# Altium project SDC_2.PrjPcb
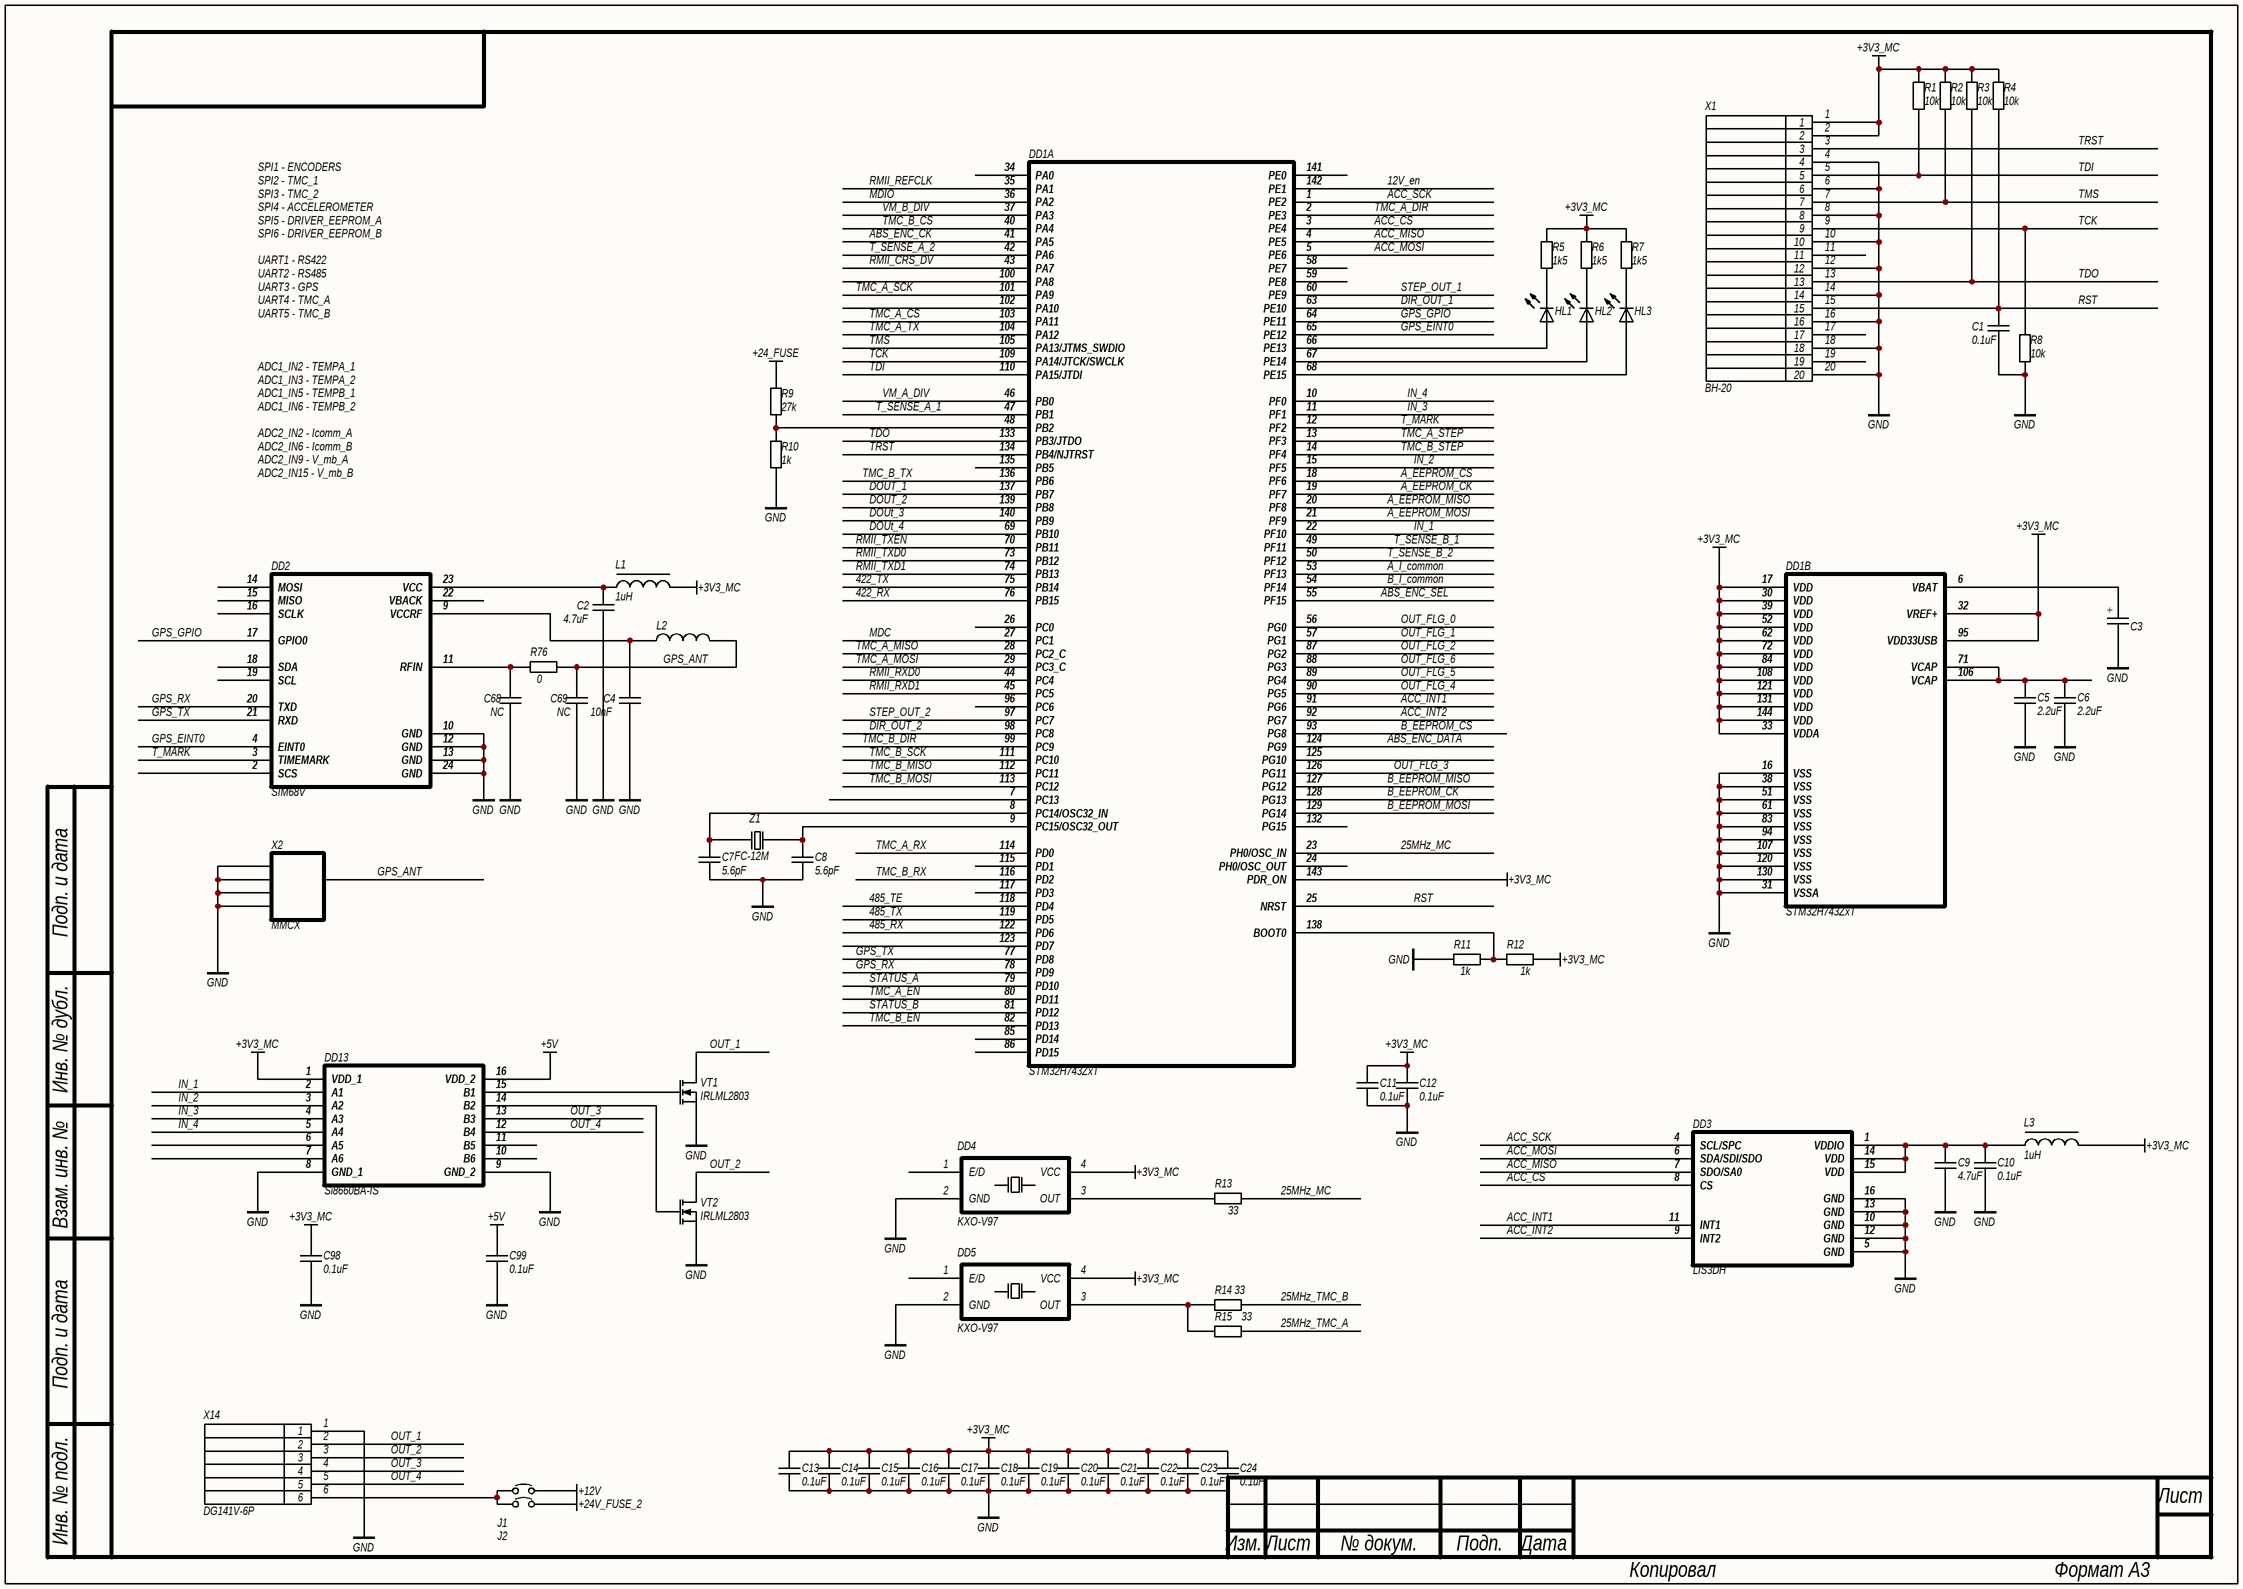
[diagram p0: SDC_1.SchDoc]
2 sheets, 135 parts. Net scope: global (net labels, ports and power ports of the same name join across sheets).
Board file: SDC.PcbDoc
Sheets:
  SDC_1.SchDoc
  SDC_2.SchDoc

## Sheet SDC_1.SchDoc
size 420 x 297 mm; Scale: {Мш.}; PageSetup: Record=PageOptions|CenterHorizontal=False|CenterVertical=False|PrintScale=0.49|XCorrection=0.00|YCorrection=0.00|PrintKind=1|BorderSize=5000000|LeftOffset=0|BottomOffset=0|Orientation=1|PaperLength=1000|PaperWidth=1000|Scale=100|PaperSource=15|PrintQuality=600|MediaType=1|DitherType=10|PrintScaleMode=1|PaperKind=A4; ProcessInspection: {Т.контр.}; Mass: {М.}; NormInspection: {Н.контр.}; Letter1Column: {}; Letter2Column: {}; Letter3Column: {}; DocumentType: {Документ}

### Parts
C1  value 0.1uF  [C0603]  (hidden comment: CAP)
C2  value 4.7uF  [C0603]  (hidden comment: CAP)
C3  KR-5R5H155-R  [KR-5R5H155-R]  (value not drawn)
C4  value 10nF  [C0603]  (hidden comment: CAP)
C5  value 2.2uF  [C0603]  (hidden comment: CAP)
C6  value 2.2uF  [C0603]  (hidden comment: CAP)
C7  value 5.6pF  [C0603]  (hidden comment: CAP)
C8  value 5.6pF  [C0603]  (hidden comment: CAP)
C9  value 4.7uF  [C0603]  (hidden comment: CAP)
C10  value 0.1uF  [C0603]  (hidden comment: CAP)
C11  value 0.1uF  [C0603]  (hidden comment: CAP)
C12  value 0.1uF  [C0603]  (hidden comment: CAP)
C13  value 0.1uF  [C0603]  (hidden comment: CAP)
C14  value 0.1uF  [C0603]  (hidden comment: CAP)
C15  value 0.1uF  [C0603]  (hidden comment: CAP)
C16  value 0.1uF  [C0603]  (hidden comment: CAP)
C17  value 0.1uF  [C0603]  (hidden comment: CAP)
C18  value 0.1uF  [C0603]  (hidden comment: CAP)
C19  value 0.1uF  [C0603]  (hidden comment: CAP)
C20  value 0.1uF  [C0603]  (hidden comment: CAP)
C21  value 0.1uF  [C0603]  (hidden comment: CAP)
C22  value 0.1uF  [C0603]  (hidden comment: CAP)
C23  value 0.1uF  [C0603]  (hidden comment: CAP)
C24  value 0.1uF  [C0603]  (hidden comment: CAP)
C68  value NC  [C0603]  (hidden comment: CAP)
C69  value NC  [C0603]  (hidden comment: CAP)
C98  value 0.1uF  [C0603]  (hidden comment: CAP)
C99  value 0.1uF  [C0603]  (hidden comment: CAP)
DD1  STM32H743ZxT  [STM-LQFP144_L]  (parts A,B of 2)
DD2  SIM68V  [SIM68M]
DD3  LIS3DH  [LGA-16]
DD4  KXO-V97  [SO4-GEN]
DD5  KXO-V97  [SO4-GEN]
DD13  Si8660BA-IS  [SO-16_N]
HL1  LED0603  [LED0603]  (value not drawn)
HL2  LED0603  [LED0603]  (value not drawn)
HL3  LED0603  [LED0603]  (value not drawn)
J1  JUMP  [JUMP]  (value not drawn)
J2  JUMP  [JUMP]  (value not drawn)
L1  value 1uH  [LQH32CN]  (hidden comment: LQH32CN)
L2  FerriteBead  [L0603]  (value not drawn)
L3  value 1uH  [LQH32CN]  (hidden comment: LQH32CN)
R1  value 10k  [R0603]  (hidden comment: RES)
R2  value 10k  [R0603]  (hidden comment: RES)
R3  value 10k  [R0603]  (hidden comment: RES)
R4  value 10k  [R0603]  (hidden comment: RES)
R5  value 1k5  [R0603]  (hidden comment: RES)
R6  value 1k5  [R0603]  (hidden comment: RES)
R7  value 1k5  [R0603]  (hidden comment: RES)
R8  value 10k  [R0603]  (hidden comment: RES)
R9  value 27k  [R0603]  (hidden comment: RES)
R10  value 1k  [R0603]  (hidden comment: RES)
R11  value 1k  [R0603]  (hidden comment: RES)
R12  value 1k  [R0603]  (hidden comment: RES)
R13  value 33  [R0603]  (hidden comment: RES)
R14  value 33  [R0603]  (hidden comment: RES)
R15  value 33  [R0603]  (hidden comment: RES)
R76  value 0  [R0603]  (hidden comment: RES)
VT1  IRLML2803  [SOT23]
VT2  IRLML2803  [SOT23]
X1  BH-20  [IDC-20(BH-20)]
X2  MMCX  [MMCX]
X14  DG141V-6P  [DG141V-06P]
Z1  FC-12M  [FC-12M]

### Nets
+3V3_MC: C11.2 C12.2 C13.2 C14.2 C15.2 C16.2 C17.2 C18.2 C19.2 C20.2 C21.2 C22.2 C23.2 C24.2 C98.2 DD1.17(VDD) DD1.30(VDD) DD1.32(VREF+) DD1.33(VDDA) DD1.39(VDD) DD1.52(VDD) DD1.62(VDD) DD1.72(VDD) DD1.84(VDD) DD1.95(VDD33USB) DD1.108(VDD) DD1.121(VDD) DD1.131(VDD) DD1.143(PDR_ON) DD1.144(VDD) DD4.4(VCC) DD5.4(VCC) DD13.1(VDD_1) L1.2 L3.2 R1.1 R2.1 R3.1 R4.1 R5.1 R6.1 R7.1 R12.1 X1.1 X1.2
+5V: C99.2 DD13.16(VDD_2)
+12V: J1.2
+24_FUSE: R9.2
+24V_FUSE_2: J2.2
GND: C1.1 C2.1 C3.1 C4.1 C5.1 C6.1 C7.1 C8.1 C9.1 C10.1 C11.1 C12.1 C13.1 C14.1 C15.1 C16.1 C17.1 C18.1 C19.1 C20.1 C21.1 C22.1 C23.1 C24.1 C68.1 C69.1 C98.1 C99.1 DD1.16(VSS) DD1.31(VSSA) DD1.38(VSS) DD1.51(VSS) DD1.61(VSS) DD1.83(VSS) DD1.94(VSS) DD1.107(VSS) DD1.120(VSS) DD1.130(VSS) DD2.10(GND) DD2.12(GND) DD2.13(GND) DD2.24(GND) DD3.5(GND) DD3.10(GND) DD3.12(GND) DD3.13(GND) DD3.16(GND) DD4.2(GND) DD5.2(GND) DD13.8(GND_1) DD13.9(GND_2) R8.2 R10.1 R11.2 VT1.2(S) VT2.2(S) X1.4 X1.6 X1.8 X1.10 X1.12 X1.14 X1.16 X1.18 X1.20 X2.1(GND) X2.2(GND) X2.3(GND) X2.4(GND) X14.1
12V_en: DD1.142(PE1)
25MHz_MC: DD1.23(PH0/OSC_IN) R13.1
25MHz_TMC_A: R15.1
25MHz_TMC_B: R14.1
422_RX: DD1.76(PB15)
422_TX: DD1.75(PB14)
485_RX: DD1.122(PD6)
485_TE: DD1.118(PD4)
485_TX: DD1.119(PD5)
A_EEPROM_CK: DD1.19(PF7)
A_EEPROM_CS: DD1.18(PF6)
A_EEPROM_MISO: DD1.20(PF8)
A_EEPROM_MOSI: DD1.21(PF9)
A_I_common: DD1.53(PF13)
ABS_ENC_CK: DD1.41(PA5)
ABS_ENC_DATA: DD1.124(PG9)
ABS_ENC_SEL: DD1.55(PF15)
ACC_CS: DD1.3(PE4) DD3.8(CS)
ACC_INT1: DD1.91(PG6) DD3.11(INT1)
ACC_INT2: DD1.92(PG7) DD3.9(INT2)
ACC_MISO: DD1.4(PE5) DD3.7(SDO/SA0)
ACC_MOSI: DD1.5(PE6) DD3.6(SDA/SDI/SDO)
ACC_SCK: DD1.1(PE2) DD3.4(SCL/SPC)
B_EEPROM_CK: DD1.128(PG13)
B_EEPROM_CS: DD1.93(PG8)
B_EEPROM_MISO: DD1.127(PG12)
B_EEPROM_MOSI: DD1.129(PG14)
B_I_common: DD1.54(PF14)
DIR_OUT_1: DD1.63(PE10)
DIR_OUT_2: DD1.98(PC8)
DOUT_1: DD1.137(PB7)
DOUT_2: DD1.139(PB8)
DOUt_3: DD1.140(PB9)
DOUt_4: DD1.69(PB10)
GPS_ANT: C69.2 L2.2 R76.1 X2.5(SYG)
GPS_EINT0: DD1.65(PE12) DD2.4(EINT0)
GPS_GPIO: DD1.64(PE11) DD2.17(GPIO0)
GPS_RX: DD1.78(PD9) DD2.20(TXD)
GPS_TX: DD1.77(PD8) DD2.21(RXD)
IN_1: DD1.22(PF10) DD13.2(A1)
IN_2: DD1.15(PF5) DD13.3(A2)
IN_3: DD1.11(PF1) DD13.4(A3)
IN_4: DD1.10(PF0) DD13.5(A4)
MDC: DD1.27(PC1)
MDIO: DD1.36(PA2)
OUT_1: VT1.3(D) X14.2
OUT_2: VT2.3(D) X14.3
OUT_3: DD13.13(B3) X14.4
OUT_4: DD13.12(B4) X14.5
OUT_FLG_0: DD1.56(PG0)
OUT_FLG_1: DD1.57(PG1)
OUT_FLG_2: DD1.87(PG2)
OUT_FLG_3: DD1.126(PG11)
OUT_FLG_4: DD1.90(PG5)
OUT_FLG_5: DD1.89(PG4)
OUT_FLG_6: DD1.88(PG3)
RMII_CRS_DV: DD1.43(PA7)
RMII_REFCLK: DD1.35(PA1)
RMII_RXD0: DD1.44(PC4)
RMII_RXD1: DD1.45(PC5)
RMII_TXD0: DD1.73(PB12)
RMII_TXD1: DD1.74(PB13)
RMII_TXEN: DD1.70(PB11)
RST: C1.2 DD1.25(NRST) R4.2 X1.15
STATUS_A: DD1.79(PD10)
STATUS_B: DD1.81(PD12)
STEP_OUT_1: DD1.60(PE9)
STEP_OUT_2: DD1.97(PC7)
T_MARK: DD1.12(PF2) DD2.3(TIMEMARK)
T_SENSE_A_1: DD1.47(PB1)
T_SENSE_A_2: DD1.42(PA6)
T_SENSE_B_1: DD1.49(PF11)
T_SENSE_B_2: DD1.50(PF12)
TCK: DD1.109(PA14/JTCK/SWCLK) R8.1 X1.9
TDI: DD1.110(PA15/JTDI) R1.2 X1.5
TDO: DD1.133(PB3/JTDO) R3.2 X1.13
TMC_A_CS: DD1.103(PA11)
TMC_A_DIR: DD1.2(PE3)
TMC_A_EN: DD1.80(PD11)
TMC_A_MISO: DD1.28(PC2_C)
TMC_A_MOSI: DD1.29(PC3_C)
TMC_A_RX: DD1.114(PD0)
TMC_A_SCK: DD1.101(PA9)
TMC_A_STEP: DD1.13(PF3)
TMC_A_TX: DD1.104(PA12)
TMC_B_CS: DD1.40(PA4)
TMC_B_DIR: DD1.99(PC9)
TMC_B_EN: DD1.82(PD13)
TMC_B_MISO: DD1.112(PC11)
TMC_B_MOSI: DD1.113(PC12)
TMC_B_RX: DD1.116(PD2)
TMC_B_SCK: DD1.111(PC10)
TMC_B_STEP: DD1.14(PF4)
TMC_B_TX: DD1.136(PB6)
TMS: DD1.105(PA13/JTMS_SWDIO) R2.2 X1.7
TRST: DD1.134(PB4/NJTRST) X1.3
VM_A_DIV: DD1.46(PB0)
VM_B_DIV: DD1.37(PA3)
NetC2_2: C2.2 DD2.23(VCC) L1.1
NetC3_2: C3.2 DD1.6(VBAT)
NetC4_2: C4.2 DD2.9(VCCRF) L2.1
NetC5_2: C5.2 C6.2 DD1.71(VCAP) DD1.106(VCAP)
NetC7_2: C7.2 DD1.8(PC14/OSC32_IN) Z1.1
NetC8_2: C8.2 DD1.9(PC15/OSC32_OUT) Z1.2
NetC9_2: C9.2 C10.2 DD3.1(VDDIO) DD3.14(VDD) DD3.15(VDD) L3.1
NetC68_2: C68.2 DD2.11(RFIN) R76.2
NetDD1_48: DD1.48(PB2) R9.1 R10.2
NetDD1_66: DD1.66(PE13) HL1.1(A)
NetDD1_67: DD1.67(PE14) HL2.1(A)
NetDD1_68: DD1.68(PE15) HL3.1(A)
NetDD1_138: DD1.138(BOOT0) R11.1 R12.2
NetDD4_3: DD4.3(OUT) R13.2
NetDD5_3: DD5.3(OUT) R14.2 R15.2
NetDD13_14: DD13.14(B2) VT2.1(G)
NetDD13_15: DD13.15(B1) VT1.1(G)
NetHL1_2: HL1.2(K) R5.2
NetHL2_2: HL2.2(K) R6.2
NetHL3_2: HL3.2(K) R7.2
NetJ1_1: J1.1 J2.1 X14.6

Not connected (* = marked no-connect by the designer): DD1 7(PC13) 24(PH0/OSC_OUT) 26(PC0) 34(PA0) 58(PE7) 59(PE8) 85(PD14) 86(PD15) 96(PC6) 100(PA8) 102(PA10) 115(PD1) 117(PD3) 123(PD7) 125(PG10) 132(PG15) 135(PB5) 141(PE0); DD2 2(SCS) 14(MOSI) 15(MISO) 16(SCLK) 18(SDA) 19(SCL) 22(VBACK); DD4 1(E/D); DD5 1(E/D); DD13 6(A5) 7(A6) 10(B6) 11(B5); X1 11 17 19

### Notes on the sheet
- SPI1 - ENCODERS
- SPI2 - TMC_1
- SPI3 - TMC_2
- SPI4 - ACCELEROMETER
- SPI5 - DRIVER_EEPROM_A
- SPI6 - DRIVER_EEPROM_B
- UART1 - RS422
- UART2 - RS485
- UART3 - GPS
- UART4 - TMC_A
- UART5 - TMC_B
- ADC1_IN2 - TEMPA_1
- ADC1_IN3 - TEMPA_2
- ADC1_IN5 - TEMPB_1
- ADC1_IN6 - TEMPB_2
- ADC2_IN2 - Icomm_A
- ADC2_IN6 - Icomm_B
- ADC2_IN9 - V_mb_A
- ADC2_IN15 - V_mb_B
- Подп. и дата
- Инв. № дубл.
- Взам. инв. №
- Инв. № подл.
- Лист
- Изм.
- № докум.
- Подп.
- Дата
- Копировал
- Формат А3
- (in symbol KR-5R5H155-R) +

### Library data of the parts
C1 C5-C8 C10-C24 C98 C99 = CAP: SMD Capacitor; Manufacturer: Murata; Material: X7R; Tolerance: 10%; Voltage: 50V; Type: Ceramic Capacitor
C2 C4 C9 C68 C69 = CAP: SMD Capacitor; Manufacturer: Murata; Material: X7R; Tolerance: 10%; Voltage: 10V; Type: Ceramic Capacitor
C3 = KR-5R5H155-R: Ionistor; Manufacturer: Murata; Voltage: 5V; Type: Aluminum; Value: 1.5F
DD1 = STM32H743ZxT: ARM Cortex-M7, 480MHz, 32-bit MCU+FPU, 144-pin LQFP
DD2 = SIM68V: GPS module
DD3 = LIS3DH: Accelerometer
DD4 DD5 = KXO-V97: KXO generator
DD13 = Si8660BA-IS: digital isolator
L1 L3 = LQH32CN: chip inductor
L2 = FerriteBead: SMD Chip ferrite bead 0603; value: 600R; PartNumber: *; Manufacturer: *
R1-R15 R76 = RES: SMD Resistor; Name: Chip SMD Resistor; Power: 0.062 Wt; Tolerance: 5%; Temperature Range: -55…155°C
VT1 VT2 = IRLML2803: n-channel fet
X1 = IDC10x2_GOST
X2 = MMCX: Coaxial
X14 = DG141V-6P: wire connector
Z1 = FC-12M: Crystal_32_768
J1 J2 = JUMP: PACKAGE: PLS2; NOTE: *

## Sheet SDC_2.SchDoc
size 420 x 297 mm; PageSetup: Record=PageOptions|CenterHorizontal=False|CenterVertical=False|PrintScale=0.95|XCorrection=0.00|YCorrection=0.00|PrintKind=1|BorderSize=5000000|LeftOffset=0|BottomOffset=0|Orientation=1|PaperLength=1000|PaperWidth=1000|Scale=100|PaperSource=15|PrintQuality=600|MediaType=1|DitherType=10|PaperKind=A4|PrintScaleMode=1
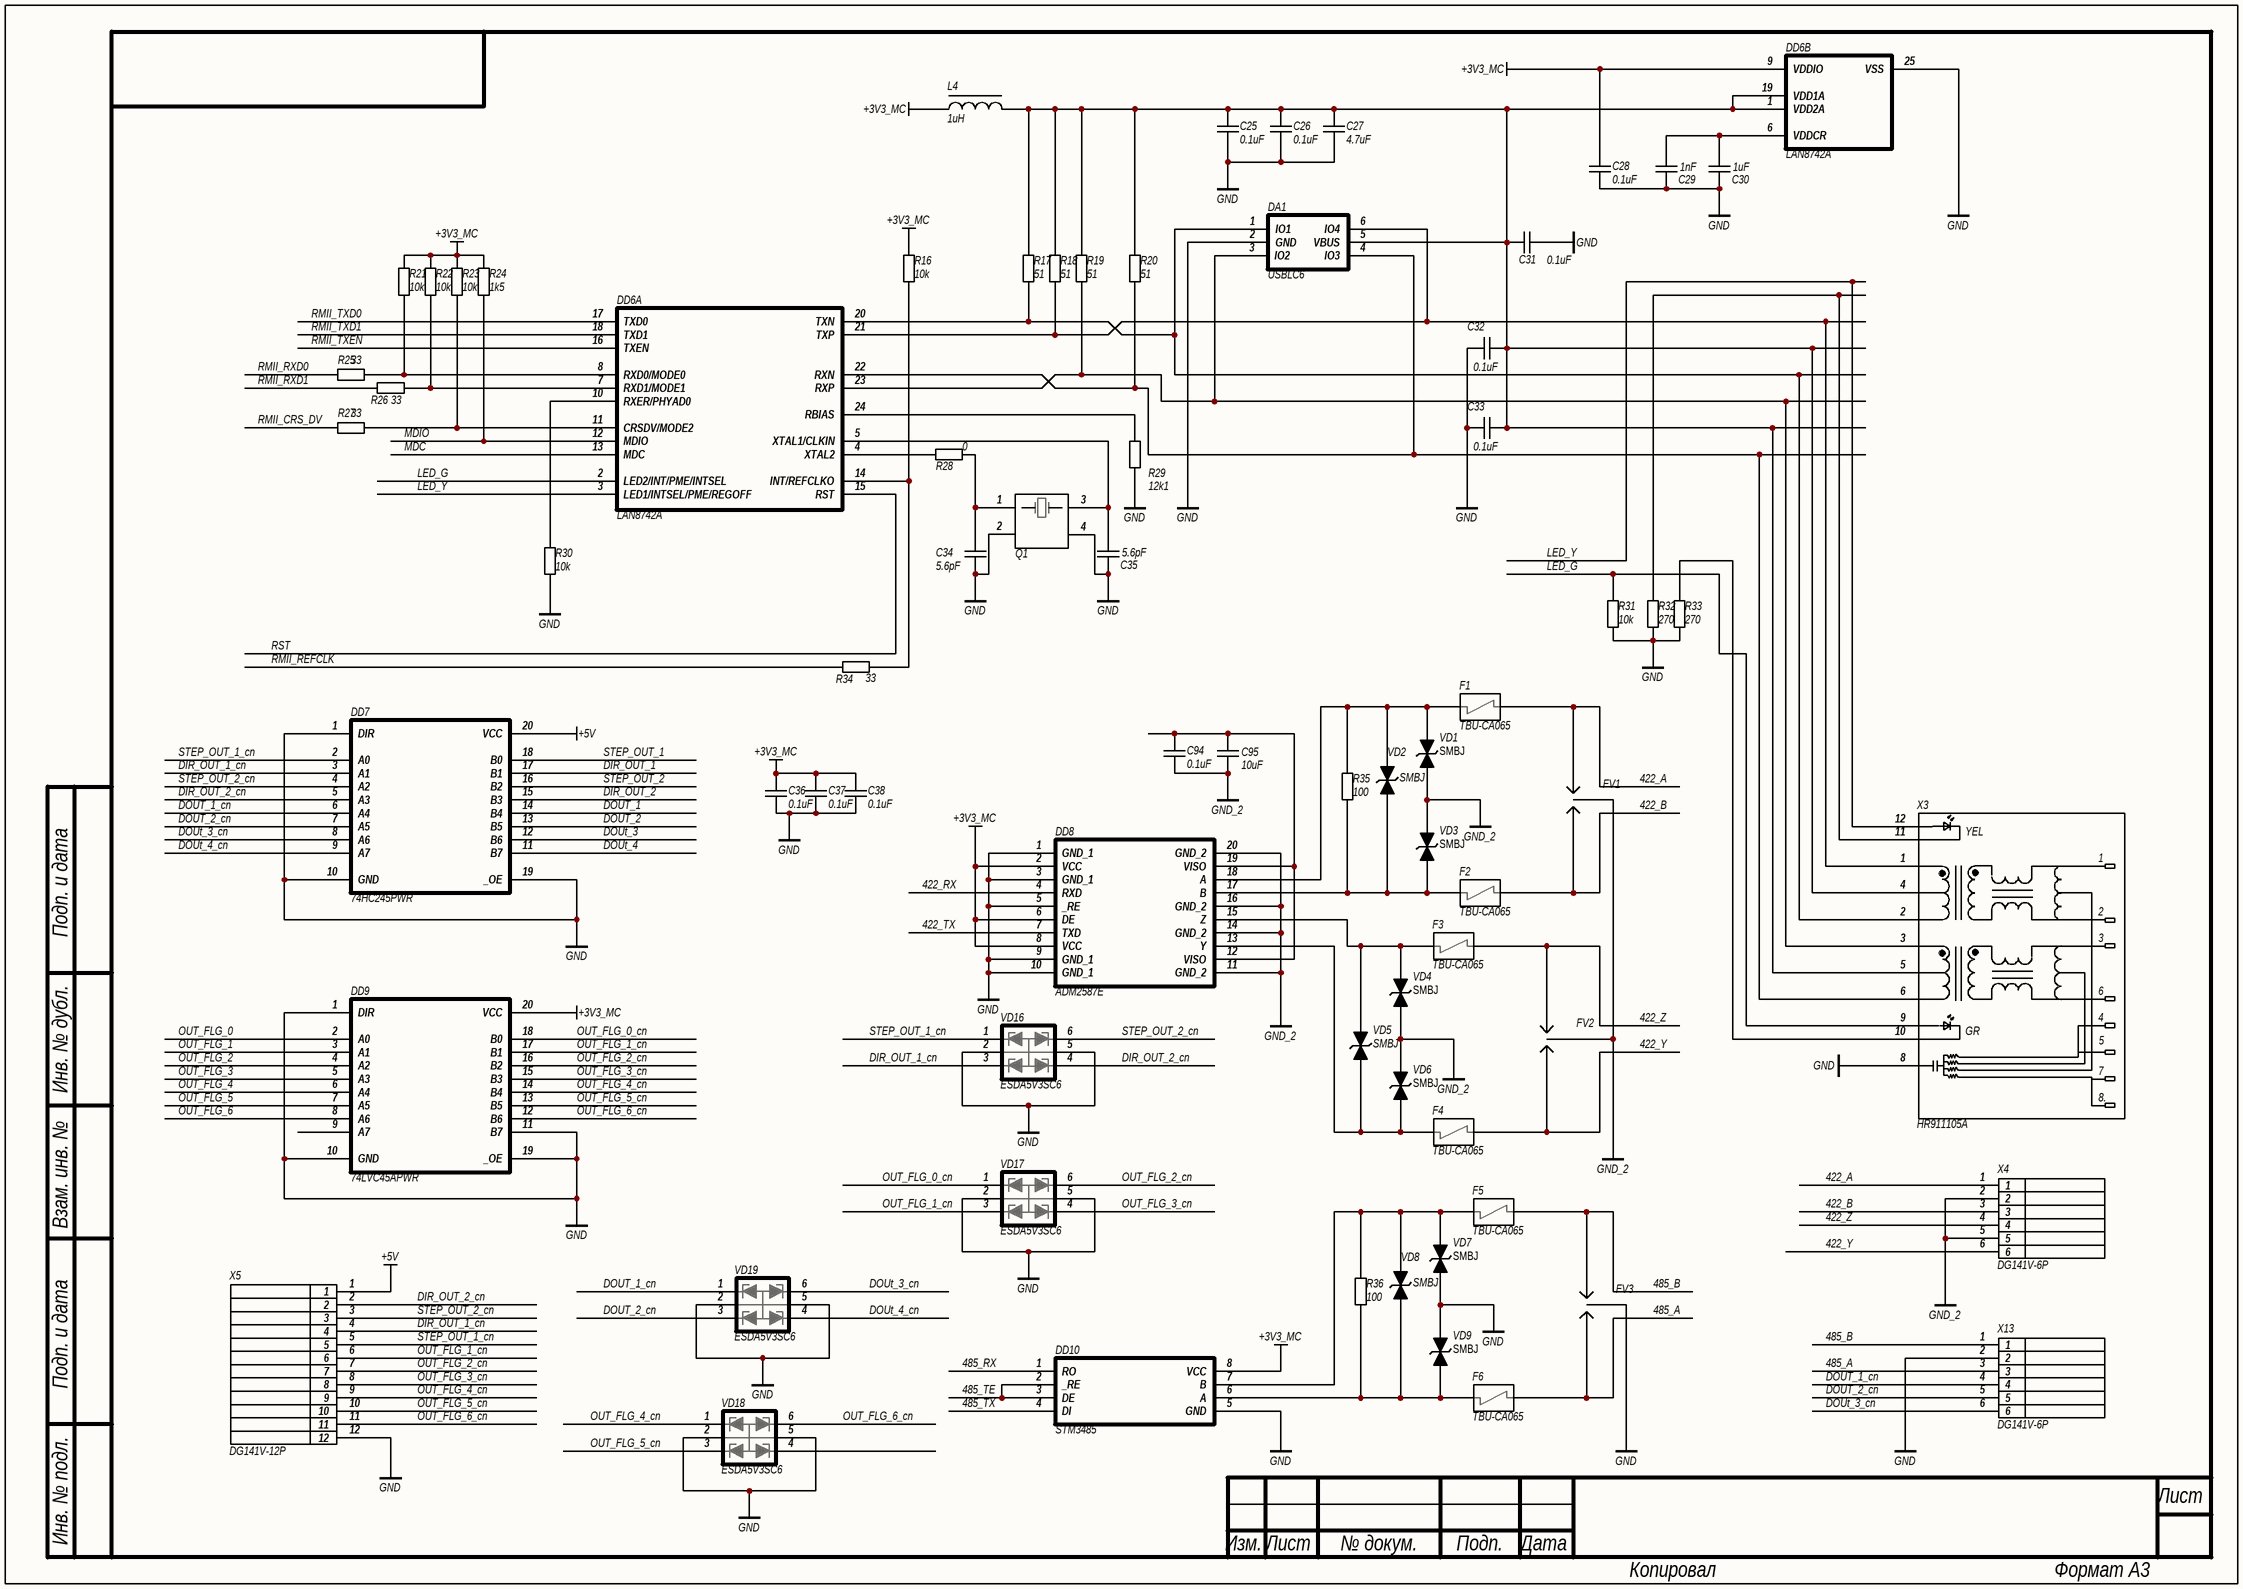
[diagram p1: SDC_2.SchDoc]

### Parts
C25  value 0.1uF  [C0603]  (hidden comment: CAP)
C26  value 0.1uF  [C0603]  (hidden comment: CAP)
C27  value 4.7uF  [C0603]  (hidden comment: CAP)
C28  value 0.1uF  [C0603]  (hidden comment: CAP)
C29  value 1nF  [C0603]  (hidden comment: CAP)
C30  value 1uF  [C0603]  (hidden comment: CAP)
C31  value 0.1uF  [C0603]  (hidden comment: CAP)
C32  value 0.1uF  [C0603]  (hidden comment: CAP)
C33  value 0.1uF  [C0603]  (hidden comment: CAP)
C34  value 5.6pF  [C0603]  (hidden comment: CAP)
C35  value 5.6pF  [C0603]  (hidden comment: CAP)
C36  value 0.1uF  [C0603]  (hidden comment: CAP)
C37  value 0.1uF  [C0603]  (hidden comment: CAP)
C38  value 0.1uF  [C0603]  (hidden comment: CAP)
C94  value 0.1uF  [C0603]  (hidden comment: CAP)
C95  value 10uF  [C1210]  (hidden comment: CAP)
DA1  USBLC6  [ESD_SOT23-6L]
DD6  LAN8742A  [QFN-MJ24]  (parts A,B of 2)
DD7  74HC245PWR  [TSSOP20]
DD8  ADM2587E  [SOIC_20W]
DD9  74LVC45APWR  [TSSOP20]
DD10  STM3485  [SO8_L]
F1  TBU-CA065  [TBU-CA]
F2  TBU-CA065  [TBU-CA]
F3  TBU-CA065  [TBU-CA]
F4  TBU-CA065  [TBU-CA]
F5  TBU-CA065  [TBU-CA]
F6  TBU-CA065  [TBU-CA]
FV1  2030-42T-SM  [2030-42T-SM]  (value not drawn)
FV2  2030-42T-SM  [2030-42T-SM]  (value not drawn)
FV3  2030-42T-SM  [2030-42T-SM]  (value not drawn)
L4  value 1uH  [LQH32CN]  (hidden comment: LQH32CN)
Q1  NX2016SA  [CRY_NX2016SA_4P]  (value not drawn)
R16  value 10k  [R0603]  (hidden comment: RES)
R17  value 51  [R0603]  (hidden comment: RES)
R18  value 51  [R0603]  (hidden comment: RES)
R19  value 51  [R0603]  (hidden comment: RES)
R20  value 51  [R0603]  (hidden comment: RES)
R21  value 10k  [R0603]  (hidden comment: RES)
R22  value 10k  [R0603]  (hidden comment: RES)
R23  value 10k  [R0603]  (hidden comment: RES)
R24  value 1k5  [R0603]  (hidden comment: RES)
R25  value 33  [R0603]  (hidden comment: RES)
R26  value 33  [R0603]  (hidden comment: RES)
R27  value 33  [R0603]  (hidden comment: RES)
R28  value 0  [R0603]  (hidden comment: RES)
R29  value 12k1  [R0603]  (hidden comment: RES)
R30  value 10k  [R0603]  (hidden comment: RES)
R31  value 10k  [R0603]  (hidden comment: RES)
R32  value 270  [R0603]  (hidden comment: RES)
R33  value 270  [R0603]  (hidden comment: RES)
R34  value 33  [R0603]  (hidden comment: RES)
R35  value 100  [R0603]  (hidden comment: RES)
R36  value 100  [R0603]  (hidden comment: RES)
VD1  SMBJ  [SMB-DO214]
VD2  SMBJ  [SMB-DO214]
VD3  SMBJ  [SMB-DO214]
VD4  SMBJ  [SMB-DO214]
VD5  SMBJ  [SMB-DO214]
VD6  SMBJ  [SMB-DO214]
VD7  SMBJ  [SMB-DO214]
VD8  SMBJ  [SMB-DO214]
VD9  SMBJ  [SMB-DO214]
VD16  ESDA5V3SC6  [SOT23-6]
VD17  ESDA5V3SC6  [SOT23-6]
VD18  ESDA5V3SC6  [SOT23-6]
VD19  ESDA5V3SC6  [SOT23-6]
X3  HR911105A  [HR911105A]
X4  DG141V-6P  [DG141V-06P]
X5  DG141V-12P  [DG141V-12P]
X13  DG141V-6P  [DG141V-06P]

### Nets
+3V3_MC: C28.2 C36.2 C37.2 C38.2 DD6.9(VDDIO) DD8.2(VCC) DD8.6(DE) DD8.8(VCC) DD9.20(VCC) DD10.8(VCC) L4.1 R16.1 R21.1 R22.1 R23.1 R24.1
+5V: DD7.20(VCC) X5.1
GND: C25.1 C26.1 C27.1 C28.1 C29.1 C30.1 C31.2 C32.1 C33.1 C34.1 C35.1 C36.1 C37.1 C38.1 DA1.2(GND) DD6.25(VSS) DD7.1(DIR) DD7.10(GND) DD7.19(_OE) DD8.1(GND_1) DD8.3(GND_1) DD8.5(_RE) DD8.9(GND_1) DD8.10(GND_1) DD9.1(DIR) DD9.10(GND) DD9.11(B7) DD9.19(_OE) DD10.5(GND) FV3.2 Q1.2(OSC1) Q1.4(OSC1) R29.1 R30.1 R31.1 R32.1 R33.1 VD7.1(A) VD9.2(B) VD16.2 VD16.5 VD17.2 VD17.5 VD18.2 VD18.5 VD19.2 VD19.5 X3.8 X5.12 X13.2
GND_2: C94.1 C95.1 DD8.11(GND_2) DD8.14(GND_2) DD8.16(GND_2) DD8.20(GND_2) FV1.2 FV2.2 VD1.1(A) VD3.2(B) VD4.1(A) VD6.2(B) X4.2 X4.5
422_A: F1.2 FV1.3 X4.1
422_B: F2.2 FV1.1 X4.3
422_RX: DD8.4(RXD)
422_TX: DD8.7(TXD)
422_Y: F4.2 FV2.1 X4.6
422_Z: F3.2 FV2.3 X4.4
485_A: F6.2 FV3.1 X13.3
485_B: F5.2 FV3.3 X13.1
485_RX: DD10.1(RO)
485_TE: DD10.2(_RE) DD10.3(DE)
485_TX: DD10.4(DI)
DIR_OUT_1: DD7.17(B1)
DIR_OUT_1_cn: DD7.3(A1) VD16.3 X5.4
DIR_OUT_2: DD7.15(B3)
DIR_OUT_2_cn: DD7.5(A3) VD16.4 X5.2
DOUT_1: DD7.14(B4)
DOUT_1_cn: DD7.6(A4) VD19.1 X13.4
DOUT_2: DD7.13(B5)
DOUT_2_cn: DD7.7(A5) VD19.3 X13.5
DOUt_3: DD7.12(B6)
DOUt_3_cn: DD7.8(A6) VD19.6 X13.6
DOUt_4: DD7.11(B7)
DOUt_4_cn: DD7.9(A7) VD19.4
LED_G: DD6.2(LED2/INT/PME/INTSEL) R31.2 X3.9
LED_Y: DD6.3(LED1/INTSEL/PME/REGOFF) X3.12
MDC: DD6.13(MDC)
MDIO: DD6.12(MDIO) R24.2
OUT_FLG_0: DD9.2(A0)
OUT_FLG_0_cn: DD9.18(B0) VD17.1
OUT_FLG_1: DD9.3(A1)
OUT_FLG_1_cn: DD9.17(B1) VD17.3 X5.6
OUT_FLG_2: DD9.4(A2)
OUT_FLG_2_cn: DD9.16(B2) VD17.6 X5.7
OUT_FLG_3: DD9.5(A3)
OUT_FLG_3_cn: DD9.15(B3) VD17.4 X5.8
OUT_FLG_4: DD9.6(A4)
OUT_FLG_4_cn: DD9.14(B4) VD18.1 X5.9
OUT_FLG_5: DD9.7(A5)
OUT_FLG_5_cn: DD9.13(B5) VD18.3 X5.10
OUT_FLG_6: DD9.8(A6)
OUT_FLG_6_cn: DD9.12(B6) VD18.6 X5.11
RMII_CRS_DV: R27.2
RMII_REFCLK: R34.2
RMII_RXD0: R25.2
RMII_RXD1: R26.2
RMII_TXD0: DD6.17(TXD0)
RMII_TXD1: DD6.18(TXD1)
RMII_TXEN: DD6.16(TXEN)
RST: DD6.15(RST)
STEP_OUT_1: DD7.18(B0)
STEP_OUT_1_cn: DD7.2(A0) VD16.1 X5.5
STEP_OUT_2: DD7.16(B2)
STEP_OUT_2_cn: DD7.4(A2) VD16.6 X5.3
NetC25_2: C25.2 C26.2 C27.2 C31.1 C32.2 C33.2 DA1.5(VBUS) DD6.1(VDD2A) DD6.19(VDD1A) L4.2 R17.2 R18.2 R19.2 R20.2 X3.4 X3.5
NetC29_2: C29.2 C30.2 DD6.6(VDDCR)
NetC34_2: C34.2 Q1.1(OSC1) R28.1
NetC35_2: C35.2 DD6.5(XTAL1/CLKIN) Q1.3(OSC2)
NetC94_2: C94.2 C95.2 DD8.12(VISO) DD8.19(VISO)
NetDA1_1: DA1.1(IO1) DD6.20(TXN) R17.1 X3.2
NetDA1_3: DA1.3(IO2) DD6.23(RXP) R19.1 X3.3
NetDA1_4: DA1.4(IO3) DD6.22(RXN) R20.1 X3.6
NetDA1_6: DA1.6(IO4) DD6.21(TXP) R18.1 X3.1
NetDD6_4: DD6.4(XTAL2) R28.2
NetDD6_7: DD6.7(RXD1/MODE1) R22.2 R26.1
NetDD6_8: DD6.8(RXD0/MODE0) R21.2 R25.1
NetDD6_10: DD6.10(RXER/PHYAD0) R30.2
NetDD6_11: DD6.11(CRSDV/MODE2) R23.2 R27.1
NetDD6_14: DD6.14(INT/REFCLKO) R16.2 R34.1
NetDD6_24: DD6.24(RBIAS) R29.2
NetDD8_13: DD8.13(Y) F4.1 VD5.1(A) VD6.1(A)
NetDD8_15: DD8.15(Z) F3.1 VD4.2(B) VD5.2(B)
NetDD8_17: DD8.17(B) F2.1 R35.2 VD2.1(A) VD3.1(A)
NetDD8_18: DD8.18(A) F1.1 R35.1 VD1.2(B) VD2.2(B)
NetDD10_6: DD10.6(A) F6.1 R36.2 VD8.1(A) VD9.1(A)
NetDD10_7: DD10.7(B) F5.1 R36.1 VD7.2(B) VD8.2(B)
NetR32_2: R32.2 X3.11
NetR33_2: R33.2 X3.10

Not connected (* = marked no-connect by the designer): DD9 9(A7); VD18 4

### Notes on the sheet
- Подп. и дата
- Инв. № дубл.
- Взам. инв. №
- Инв. № подл.
- Лист
- Изм.
- № докум.
- Подп.
- Дата
- Копировал
- Формат А3
- (in symbol HR911105A) YEL; GR; 7; 8.

### Library data of the parts
C25-C38 C94 = CAP: as C1 on sheet SDC_1
C95 = CAP: as C2 on sheet SDC_1
DA1 = USBLC6-4SC6: ESD protection Very low capacitance; Manufacturer: ST
DD6 = LAN8742A: RMII 10/100 Ethernet PHY
DD8 = ADM2587E: RS485 isolator
DD10 = ST3485EB: RS485_tranciever
F1-F6 = TBU-CA065: TBU fuse
FV1-FV3 = 2030-42T-SM: Charger
L4 = LQH32CN: chip inductor
Q1 = NX2016SA: Crystal oscillator 25MHz; Manufacturer: NDK; value: 25MHz
R16-R36 = RES: as R1 on sheet SDC_1; Temperature Range: -55…155°C
VD1 VD3 VD4 VD6 VD7 VD9 = SMBJ5CA: TVS diode
VD2 VD5 VD8 = SMBJ12CA: TVSdiode
VD16-VD19 = ESDA5V3SC6: 4-line ESD protection
X4 X13 = DG141V-6P: wire connector
X5 = DG141V-12P: wire connector

## Nets that join several sheets
+3V3_MC: SDC_1 (45 pins), SDC_2 (16 pins)
+5V: SDC_1 (C99.2 DD13.16), SDC_2 (DD7.20 X5.1)
GND: SDC_1 (70 pins), SDC_2 (50 pins)
422_RX: SDC_1 (DD1.76), SDC_2 (DD8.4)
422_TX: SDC_1 (DD1.75), SDC_2 (DD8.7)
485_RX: SDC_1 (DD1.122), SDC_2 (DD10.1)
485_TE: SDC_1 (DD1.118), SDC_2 (DD10.2 DD10.3)
485_TX: SDC_1 (DD1.119), SDC_2 (DD10.4)
DIR_OUT_1: SDC_1 (DD1.63), SDC_2 (DD7.17)
DIR_OUT_2: SDC_1 (DD1.98), SDC_2 (DD7.15)
DOUT_1: SDC_1 (DD1.137), SDC_2 (DD7.14)
DOUT_2: SDC_1 (DD1.139), SDC_2 (DD7.13)
DOUt_3: SDC_1 (DD1.140), SDC_2 (DD7.12)
DOUt_4: SDC_1 (DD1.69), SDC_2 (DD7.11)
MDC: SDC_1 (DD1.27), SDC_2 (DD6.13)
MDIO: SDC_1 (DD1.36), SDC_2 (DD6.12 R24.2)
OUT_FLG_0: SDC_1 (DD1.56), SDC_2 (DD9.2)
OUT_FLG_1: SDC_1 (DD1.57), SDC_2 (DD9.3)
OUT_FLG_2: SDC_1 (DD1.87), SDC_2 (DD9.4)
OUT_FLG_3: SDC_1 (DD1.126), SDC_2 (DD9.5)
OUT_FLG_4: SDC_1 (DD1.90), SDC_2 (DD9.6)
OUT_FLG_5: SDC_1 (DD1.89), SDC_2 (DD9.7)
OUT_FLG_6: SDC_1 (DD1.88), SDC_2 (DD9.8)
RMII_CRS_DV: SDC_1 (DD1.43), SDC_2 (R27.2)
RMII_REFCLK: SDC_1 (DD1.35), SDC_2 (R34.2)
RMII_RXD0: SDC_1 (DD1.44), SDC_2 (R25.2)
RMII_RXD1: SDC_1 (DD1.45), SDC_2 (R26.2)
RMII_TXD0: SDC_1 (DD1.73), SDC_2 (DD6.17)
RMII_TXD1: SDC_1 (DD1.74), SDC_2 (DD6.18)
RMII_TXEN: SDC_1 (DD1.70), SDC_2 (DD6.16)
RST: SDC_1 (C1.2 DD1.25 R4.2 X1.15), SDC_2 (DD6.15)
STEP_OUT_1: SDC_1 (DD1.60), SDC_2 (DD7.18)
STEP_OUT_2: SDC_1 (DD1.97), SDC_2 (DD7.16)